# EAGLE design BlinkyClock (EAGLE 5.11)
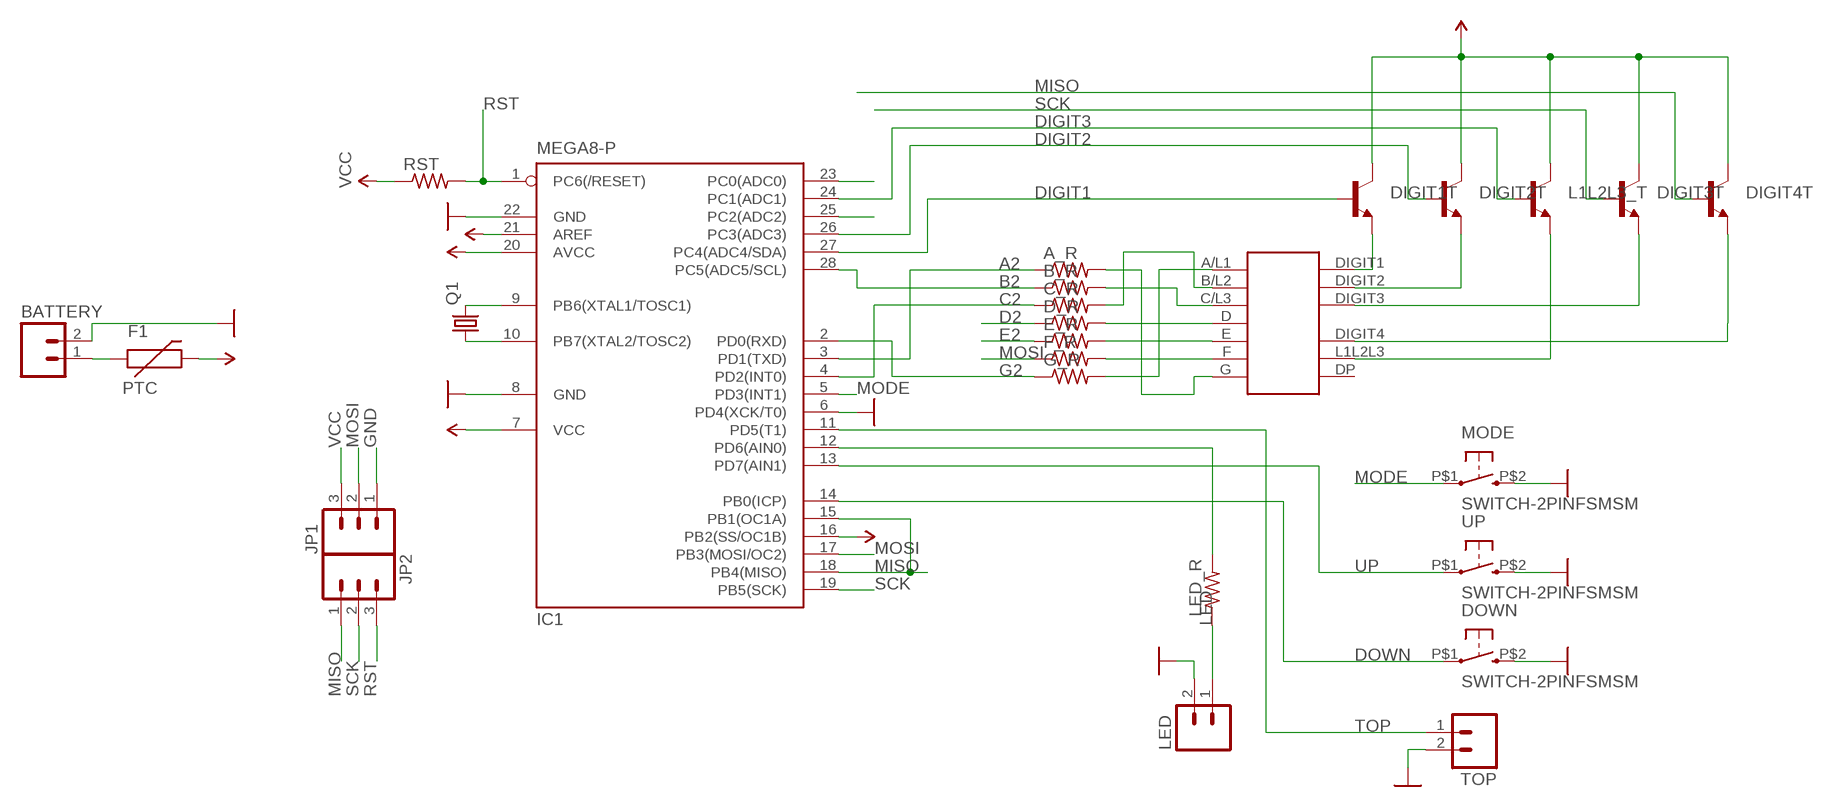
[diagram p0: schematic, sheet 1]

## Parts
A_R  R-US_R0805  [R0805]
B_R  R-US_R0805  [R0805]
BATTERY  M02PTH  [1X02]
C_R  R-US_R0805  [R0805]
D_R  R-US_R0805  [R0805]
DIGIT1T  TRANSISTOR_NPNSOT23  [SOT23]
DIGIT2T  TRANSISTOR_NPNSOT23  [SOT23]
DIGIT3T  TRANSISTOR_NPNSOT23  [SOT23]
DIGIT4T  TRANSISTOR_NPNSOT23  [SOT23]
DOWN  SWITCH-2PINFSMSM  [FSMSM-BUTTON]
E_R  R-US_R0805  [R0805]
F1  PTC  [R0805]
F_R  R-US_R0805  [R0805]
G_R  R-US_R0805  [R0805]
IC1  MEGA8-P  [DIL28-3]
JP1  M03PTH  [1X03]
JP2  M03PTH  [1X03]
L1L2L3_T  TRANSISTOR_NPNSOT23  [SOT23]
LED  M02PTH  [1X02]
LED_R  R-US_R0805  [R0805]
MODE  SWITCH-2PINFSMSM  [FSMSM-BUTTON]
Q1  CRYSTALTC26H  [TC26H]
RST  R-US_R0805  [R0805]
TOP  M02PTH  [1X02]
U$1  LTC-4627JRLTC-4627JR  [LTC-4627JR]
UP  SWITCH-2PINFSMSM  [FSMSM-BUTTON]

## Nets
A1: G_R.2 U$1.A/L1
A2: A_R.1 IC1.3(PD1(TXD))
B1: C_R.2 U$1.B/L2
B2: B_R.1 IC1.28(PC5(ADC5/SCL))
C1: B_R.2 U$1.C/L3
C2: C_R.1 IC1.4(PD2(INT0))
D1: D_R.2 U$1.D
D2: D_R.1 IC1.25(PC2(ADC2))
DIGIT1: DIGIT1T.1(B) IC1.27(PC4(ADC4/SDA))
DIGIT1E: DIGIT1T.2(E) U$1.DIGIT1
DIGIT2: DIGIT2T.1(B) IC1.26(PC3(ADC3))
DIGIT2E: DIGIT2T.2(E) U$1.DIGIT2
DIGIT3: IC1.24(PC1(ADC1)) L1L2L3_T.1(B)
DIGIT3E: DIGIT3T.2(E) U$1.DIGIT3
DIGIT4E: DIGIT4T.2(E) U$1.DIGIT4
DOWN: DOWN.P$1 IC1.14(PB0(ICP))
E1: E_R.2 U$1.E
E2: E_R.1 IC1.23(PC0(ADC0))
F1: F_R.2 U$1.F
G1: A_R.2 U$1.G
G2: G_R.1 IC1.2(PD0(RXD))
GND: BATTERY.2 DOWN.P$2 IC1.6(PD4(XCK/T0)) IC1.8(GND) IC1.22(GND) JP1.1 LED.2 MODE.P$2 TOP.2 UP.P$2
L1L2L3E: L1L2L3_T.2(E) U$1.L1L2L3
LED: IC1.12(PD6(AIN0)) LED_R.2
MISO: DIGIT4T.1(B) IC1.15(PB1(OC1A)) IC1.18(PB4(MISO)) JP2.1
MODE: IC1.5(PD3(INT1)) MODE.P$1
MOSI: F_R.1 IC1.17(PB3(MOSI/OC2)) JP1.2
N$1: LED.1 LED_R.1
N$2: BATTERY.1 F1.1
RST: IC1.1(PC6(/RESET)) JP2.3 RST.2
SCK: DIGIT3T.1(B) IC1.19(PB5(SCK)) JP2.2
TOP: IC1.11(PD5(T1)) TOP.1
UP: IC1.13(PD7(AIN1)) UP.P$1
VCC: DIGIT1T.3(C) DIGIT2T.3(C) DIGIT3T.3(C) DIGIT4T.3(C) F1.2 IC1.7(VCC) IC1.16(PB2(SS/OC1B)) IC1.20(AVCC) IC1.21(AREF) JP1.3 L1L2L3_T.3(C) RST.1
XTAL1: IC1.9(PB6(XTAL1/TOSC1)) Q1.2
XTAL2: IC1.10(PB7(XTAL2/TOSC2)) Q1.1
Unconnected: U$1.DP

## Library data of the parts
A_R B_R C_R D_R E_R F_R G_R LED_R RST = resistor:R-US_: RESISTOR, American symbol
BATTERY LED TOP = SparkFun:M02: Header 2 Standard 2-pin 0.1" header. Use with straight break away headers (SKU : PRT-00116), right angle break away headers (PRT-00553), swiss pins (PRT-00743), machine pins (PRT-00117), and female headers (PRT-00115). Molex polarized connector foot print use with SKU : PRT-08233 with associated crimp pins and housings.
DIGIT1T DIGIT2T DIGIT3T DIGIT4T L1L2L3_T = SparkFun:TRANSISTOR_NPN: Transistor NPN BJT configuration in SOT23 package. MMBT2222 is the common NPN we use. Double check BCE configuration again layout.
DOWN MODE UP = Mine:SWITCH-2PIN
F1 = Mine:PTC: Resettable Fuse PTC Resettable Fuse. Spark Fun Electronics SKU : COM-08357
IC1 = atmel:MEGA8-P: MICROCONTROLLER 8 Kbytes FLASH, 1 kbytes SRAM, 512 bytes EEPROM, USART, 4-channel 10 bit ADC, 2-channel 8 bit ADC Pin compatible with Atmega48, ATMega88, ATMega168 Source: avr.lbr; OC_FARNELL: unknown; OC_NEWARK: unknown
JP1 JP2 = SparkFun:M03: Header 3 Standard 3-pin 0.1" header. Use with straight break away headers (SKU : PRT-00116), right angle break away headers (PRT-00553), swiss pins (PRT-00743), machine pins (PRT-00117), and female headers (PRT-00115). Molex polarized connector foot print use with SKU : PRT-08232 with associated crimp pins and housings.
Q1 = SparkFun:CRYSTAL: Crystals Various standard crystals. Proven footprints. Spark Fun Electronics SKU : COM-00534
U$1 = Mine:LTC-4627JR

## Board
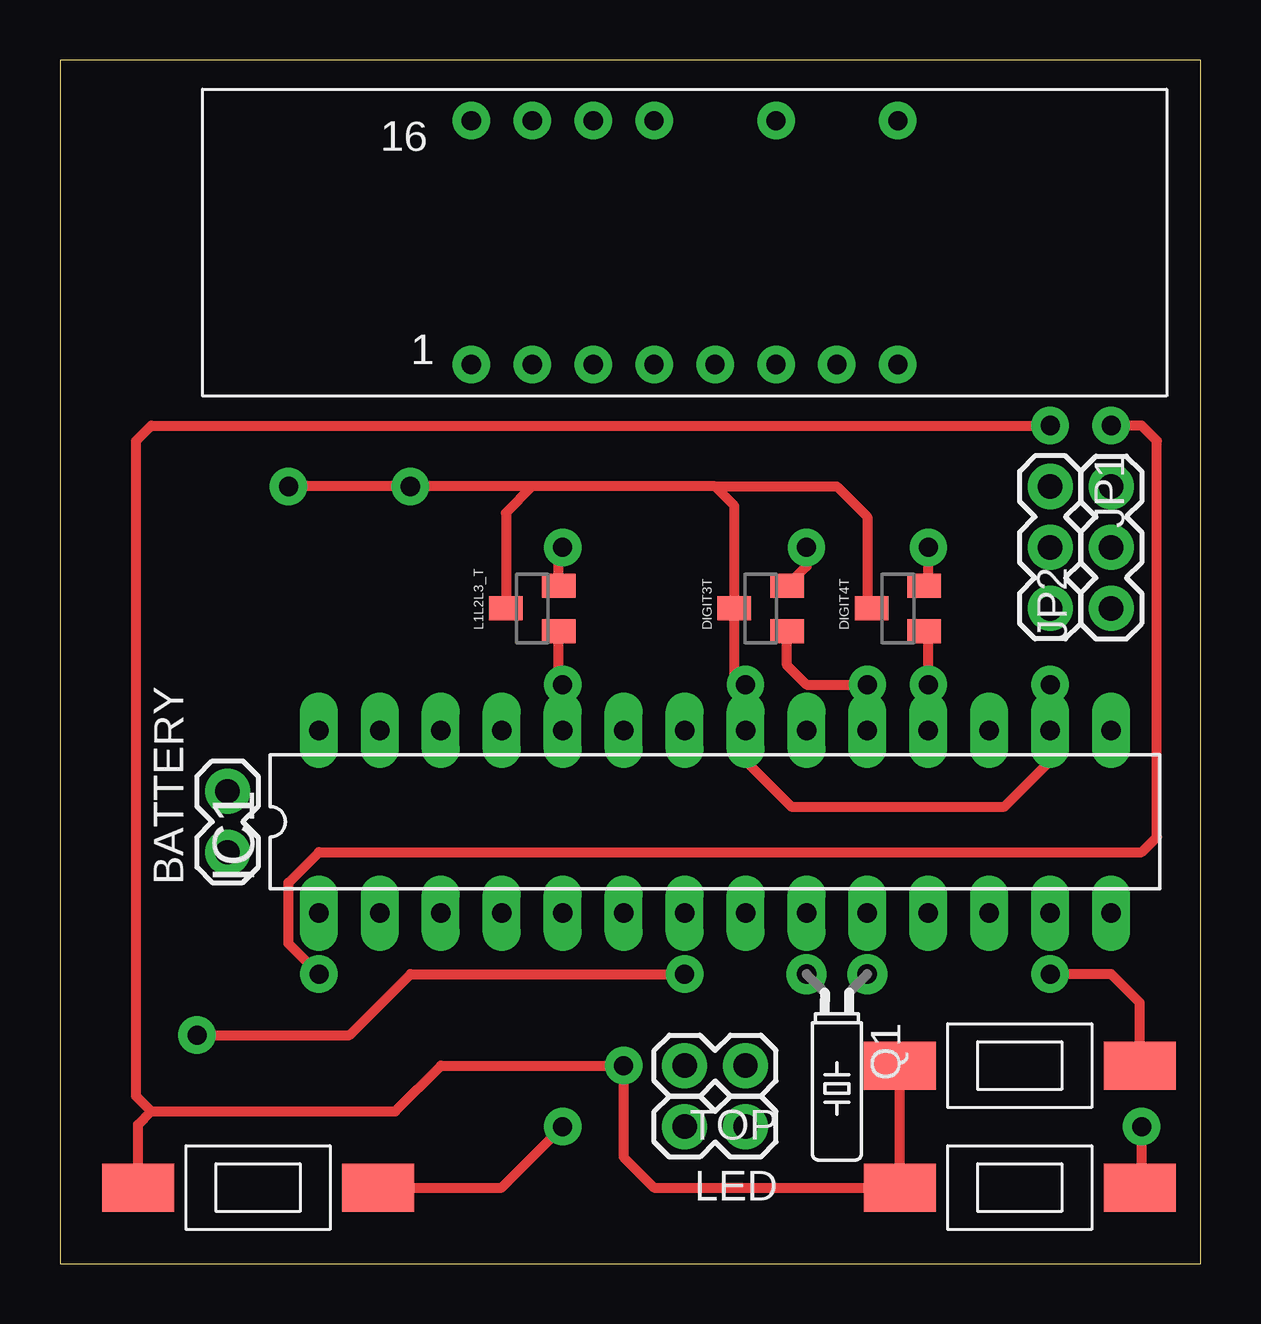
[diagram p1: board, top side]
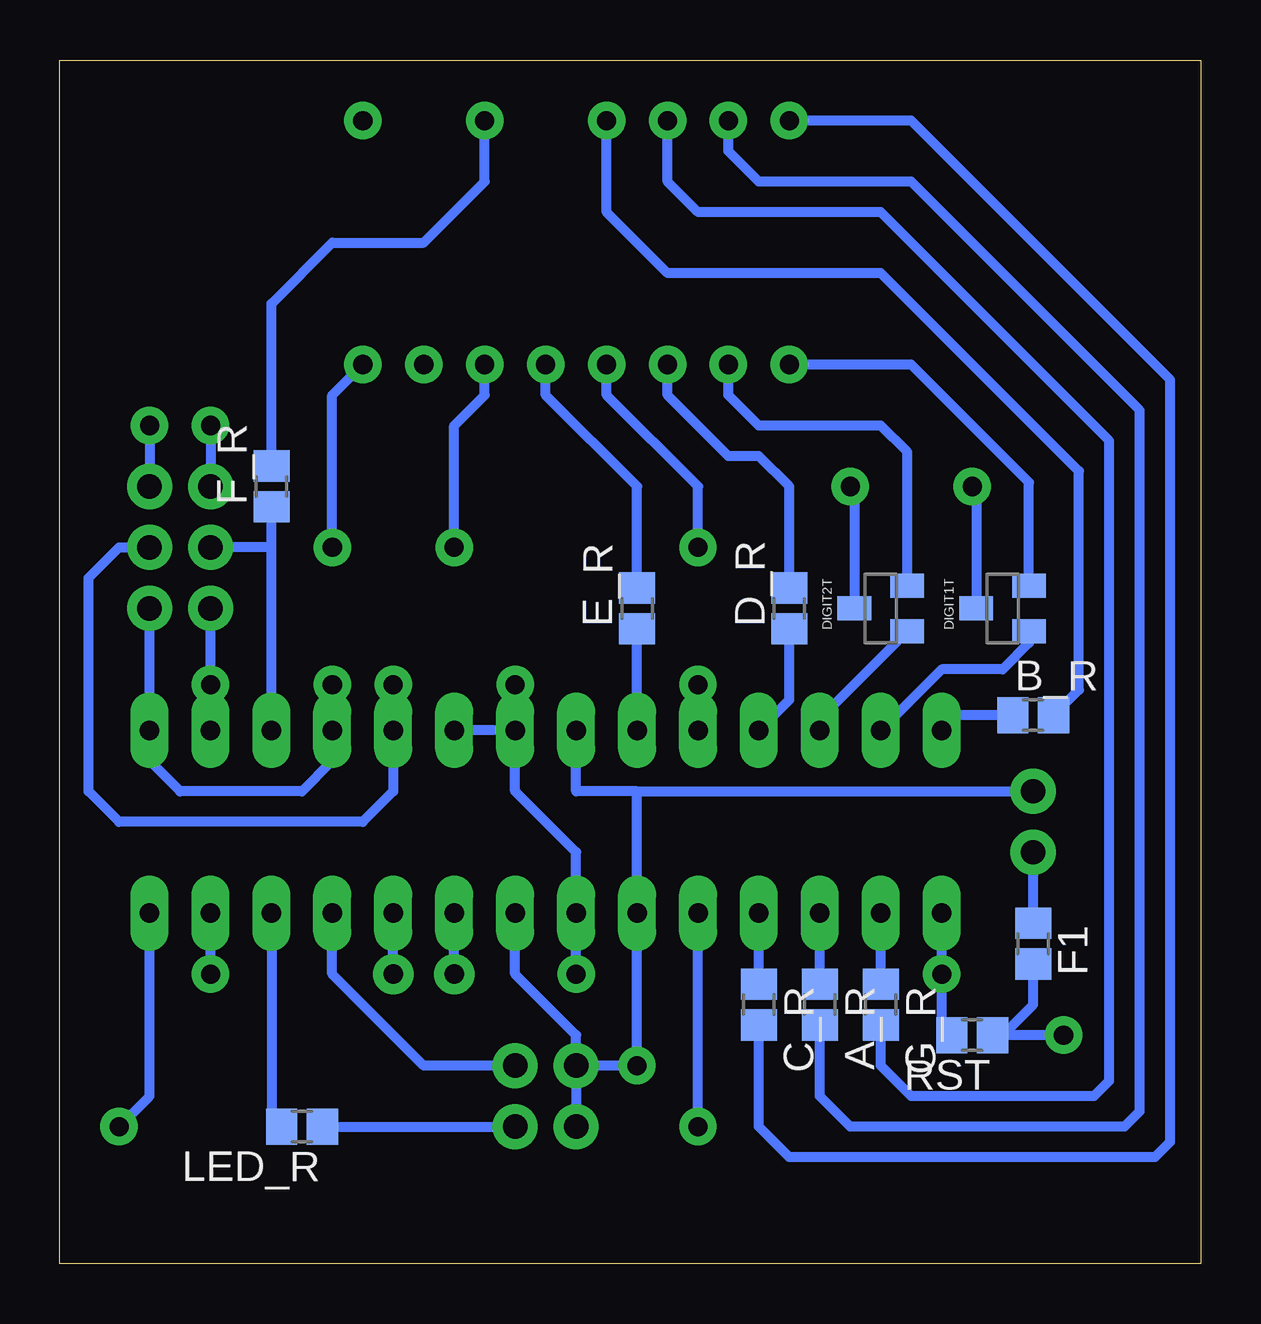
[diagram p2: board, bottom side, seen from below]

Size 47.55 x 50.16 mm. Coordinates in mm from the lower left corner, seen from the top.
Outline: 0,0 47.55,0 47.55,50.16 0,50.16 0,0
Copper layers (1*16): Top 0.035mm / dielectric 1.5mm / Bottom 0.035mm
Design rules "default *": minimum track width 15mil, minimum drill 31mil, track to track 20mil, track to pad 20mil, pad to pad 20mil, via to via 20mil, smd to smd 0mil, copper to edge 40mil, drill to drill 20mil, minimum pad ring 15mil, minimum via ring 15mil, stop-mask expansion 4mil, vias tented up to drill 0mil, thermal gap 10mil

### Footprints (pad centres in the part's own frame; a part is rotated, then mirrored left to right if it is on the bottom)
R0805 = smd 1.3 x 1.5: 1 -0.85,0; 2 0.85,0
1X02 = drill 1.016 pad 1.88 round: 1 0,0; 2 2.54,0
SOT23 = smd 1 x 1.4: 1 -0.95,-1.1; 2 0.95,-1.1; 3 0,1.1
FSMSM-BUTTON = smd 3 x 2: P$1 5,0; P$2 -5,0
DIL28-3 = drill 0.813 long: 1 -16.51,-3.81; 2 -13.97,-3.81; 3 -11.43,-3.81; 4 -8.89,-3.81; 5 -6.35,-3.81; 6 -3.81,-3.81; 7 -1.27,-3.81; 8 1.27,-3.81; 9 3.81,-3.81; 10 6.35,-3.81; 11 8.89,-3.81; 12 11.43,-3.81; 13 13.97,-3.81; 14 16.51,-3.81; 15 16.51,3.81; 16 13.97,3.81; 17 11.43,3.81; 18 8.89,3.81; 19 6.35,3.81; 20 3.81,3.81; 21 1.27,3.81; 22 -1.27,3.81; 23 -3.81,3.81; 24 -6.35,3.81; 25 -8.89,3.81; 26 -11.43,3.81; 27 -13.97,3.81; 28 -16.51,3.81
1X03 = drill 1.016 pad 1.88 round: 1 0,0; 2 2.54,0; 3 5.08,0
TC26H = drill 0.813 pad 1.676 round: 1 -1.27,0; 2 1.27,0
LTC-4627JR = drill 0.8 round: A/L1 -3.81,5.08; B/L2 -8.89,5.08; C/L3 -1.27,5.08; D -3.81,-5.08; DIGIT1 -8.89,-5.08; DIGIT2 -6.35,-5.08; DIGIT3 3.81,-5.08; DIGIT4 8.89,-5.08; DP 6.35,-5.08; E 1.27,-5.08; F 3.81,5.08; G -6.35,5.08; L1L2L3 -1.27,-5.08; NC 8.89,5.08

### Placement (x,y rotation side)
A_R  15.88,10.79 270 bottom
B_R  6.98,22.86 0 bottom
BATTERY  6.98,17.15 90 top
C_R  18.42,10.79 270 bottom
D_R  17.14,27.3 90 bottom
DIGIT1T  8.25,27.3 90 bottom
DIGIT2T  13.34,27.3 90 bottom
DIGIT3T  29.21,27.3 90 top
DIGIT4T  34.92,27.3 90 top
DOWN  40,3.18 0 top
E_R  23.5,27.3 90 bottom
F1  6.98,13.33 270 bottom
F_R  38.73,32.39 90 bottom
G_R  13.34,10.79 270 bottom
IC1  27.3,18.41 0 top
JP1  41.28,32.39 270 top
JP2  43.81,27.3 90 top
L1L2L3_T  19.68,27.3 90 top
LED  28.57,5.72 180 top
LED_R  37.47,5.72 180 bottom
MODE  8.25,3.18 0 top
Q1  32.39,12.06 180 top
RST  9.52,9.53 180 bottom
TOP  28.57,8.26 180 top
U$1  26.04,42.55 0 top
UP  40,8.26 0 top

### Tracks (layer width: path | path; a pad name or v marks a point on that pad's centre or on a via)
A1
  Bottom 0.406: G_R.2 13.34,8.26 12.07,6.99 4.45,6.99 3.81,7.62 3.81,34.29 13.34,43.82 20.96,43.82 22.22,45.09 U$1.A/L1
A2
  Bottom 0.406: A_R.1 IC1.3
B1
  Bottom 0.406: U$1.B/L2 12.07,47.62 1.27,36.83 1.27,5.08 1.91,4.45 17.14,4.45 18.42,5.72 C_R.2
B2
  Bottom 0.406: IC1.28 10.16,22.86 B_R.1
C1
  Bottom 0.406: U$1.C/L3 24.76,43.82 22.22,41.28 13.34,41.28 5.08,33.02 5.08,23.91 B_R.2
C2
  Bottom 0.406: C_R.1 IC1.4
D1
  Bottom 0.406: U$1.D 22.22,36.2 19.68,33.66 18.42,33.66 17.14,32.39 D_R.2
D2
  Bottom 0.406: IC1.25 17.14,23.5 D_R.1
DIGIT1
  Bottom 0.406: IC1.27 10.79,24.77 8.25,24.77 7.16,25.87 DIGIT1T.1
DIGIT1E
  Bottom 0.406: DIGIT1T.2 7.16,32.55 12.07,37.47 U$1.DIGIT1
DIGIT2
  Bottom 0.406: IC1.26 15.88,22.72 DIGIT2T.1
DIGIT2E
  Bottom 0.406: U$1.DIGIT2 19.68,36.2 18.42,34.93 13.34,34.93 12.23,33.83 DIGIT2T.2
DIGIT3  (via drill 0.79)
  Top 0.406: L1L2L3_T.1 20.79,24.3 v20.96,24.13
  Bottom 0.406: IC1.24 v20.96,24.13
DIGIT3E  (via drill 0.79)
  Top 0.406: v31.11,29.84 31.11,29.06 DIGIT3T.2
  Bottom 0.406: v31.11,29.84 31.11,34.93 29.85,36.2 U$1.DIGIT3
DIGIT4E  (via drill 0.79)
  Top 0.406: v36.19,29.84 36.19,28.43 DIGIT4T.2
  Bottom 0.406: U$1.DIGIT4 36.19,36.2 v36.19,29.84
DOWN  (via drill 0.79)
  Top 0.406: v45.08,5.72 45.08,3.26 DOWN.P$1
  Bottom 0.406: IC1.14 43.81,6.99 v45.08,5.72
E1
  Bottom 0.406: U$1.E 27.3,36.2 23.5,32.39 E_R.2
E2
  Bottom 0.406: IC1.23 E_R.1
F1
  Bottom 0.406: U$1.F 29.85,45.09 32.39,42.55 36.19,42.55 38.73,40.01 F_R.2
G1
  Bottom 0.406: A_R.2 15.88,6.99 14.61,5.72 3.18,5.72 2.54,6.35 2.54,35.56 12.07,45.09 18.42,45.09 19.68,46.36 U$1.G
G2
  Bottom 0.406: G_R.1 IC1.2
GND  (via drill 0.79)
  Top 0.406: 3.81,6.35 3.18,6.99 3.18,34.29 3.81,34.93 v41.28,34.93 | 3.81,6.35 13.97,6.35 15.88,8.26 v23.5,8.26 23.5,4.45 24.76,3.18 DOWN.P$2 UP.P$2 | MODE.P$2 3.25,5.79 3.81,6.35
  Bottom 0.406: IC1.22 26.04,19.69 23.5,19.69 | 23.5,19.69 BATTERY.2 | TOP.2 v23.5,8.26 IC1.6 23.5,19.69 | TOP.2 LED.2 | v41.28,34.93 JP1.1 | IC1.8 28.57,12.06 26.04,9.53 TOP.2
L1L2L3E  (via drill 0.79)
  Top 0.406: L1L2L3_T.2 20.79,29.68 v20.96,29.84
  Bottom 0.406: U$1.L1L2L3 24.76,36.2 20.96,32.39 v20.96,29.84
LED
  Bottom 0.406: IC1.12 38.73,5.72 LED_R.2
MISO  (via drill 0.79)
  Top 0.406: v36.19,24.13 36.19,26.19 DIGIT4T.1
  Bottom 0.406: v36.19,24.13 IC1.18 36.19,20.96 37.47,19.69 42.55,19.69 43.81,20.96 IC1.15 JP2.1
MODE  (via drill 0.79)
  Top 0.406: v20.96,5.72 18.42,3.18 MODE.P$1
  Bottom 0.406: v20.96,5.72 IC1.5
MOSI
  Bottom 0.406: IC1.17 38.73,29.84 | 38.73,29.84 F_R.1 | 38.73,29.84 JP1.2
N$1
  Bottom 0.406: LED_R.1 LED.1
N$2
  Bottom 0.406: F1.1 BATTERY.1
RST  (via drill 0.79)
  Top 0.406: v10.79,12.06 9.52,13.33 9.52,15.88 10.79,17.15 45.08,17.15 45.72,17.78 45.72,34.29 45.08,34.93 v43.81,34.93
  Bottom 0.406: IC1.1 v10.79,12.06 10.79,9.95 RST.2 | v43.81,34.93 JP2.3
SCK  (via drill 0.79)
  Top 0.406: DIGIT3T.1 30.31,24.94 31.11,24.13 v33.66,24.13
  Bottom 0.406: JP2.2 45.08,29.84 46.36,28.58 46.36,19.69 45.08,18.41 34.92,18.41 33.66,19.69 IC1.19 v33.66,24.13
TOP
  Bottom 0.406: IC1.11 36.19,12.06 32.39,8.26 TOP.1
UP  (via drill 0.79)
  Top 0.406: UP.P$1 45,10.88 43.81,12.06 v41.28,12.06
  Bottom 0.406: v41.28,12.06 IC1.13
VCC  (via drill 0.79)
  Top 0.406: v9.52,32.39 v14.61,32.39 19.68,32.39 | 27.3,32.39 19.68,32.39 | 27.3,32.39 32.39,32.39 33.66,31.12 33.66,27.48 DIGIT4T.3 | L1L2L3_T.3 18.58,31.29 19.68,32.39 | 27.3,32.39 28.11,31.58 DIGIT3T.3 28.11,24.59 v28.57,24.13 28.57,20.96 30.48,19.05 39.37,19.05 41.28,20.96 v41.28,24.13 | v5.71,9.53 12.07,9.53 14.61,12.06 v26.04,12.06
  Bottom 0.406: v26.04,12.06 IC1.7 26.04,17.15 28.57,19.69 IC1.21 | DIGIT1T.3 9.36,32.22 v9.52,32.39 | DIGIT2T.3 14.43,32.22 v14.61,32.39 | IC1.21 IC1.20 | IC1.21 v28.57,24.13 | F1.2 6.98,10.79 8.25,9.53 RST.1 v5.71,9.53 | JP1.3 v41.28,24.13 IC1.16
XTAL1
  Bottom 0.406: Q1.2 IC1.9
XTAL2
  Bottom 0.406: Q1.1 IC1.10